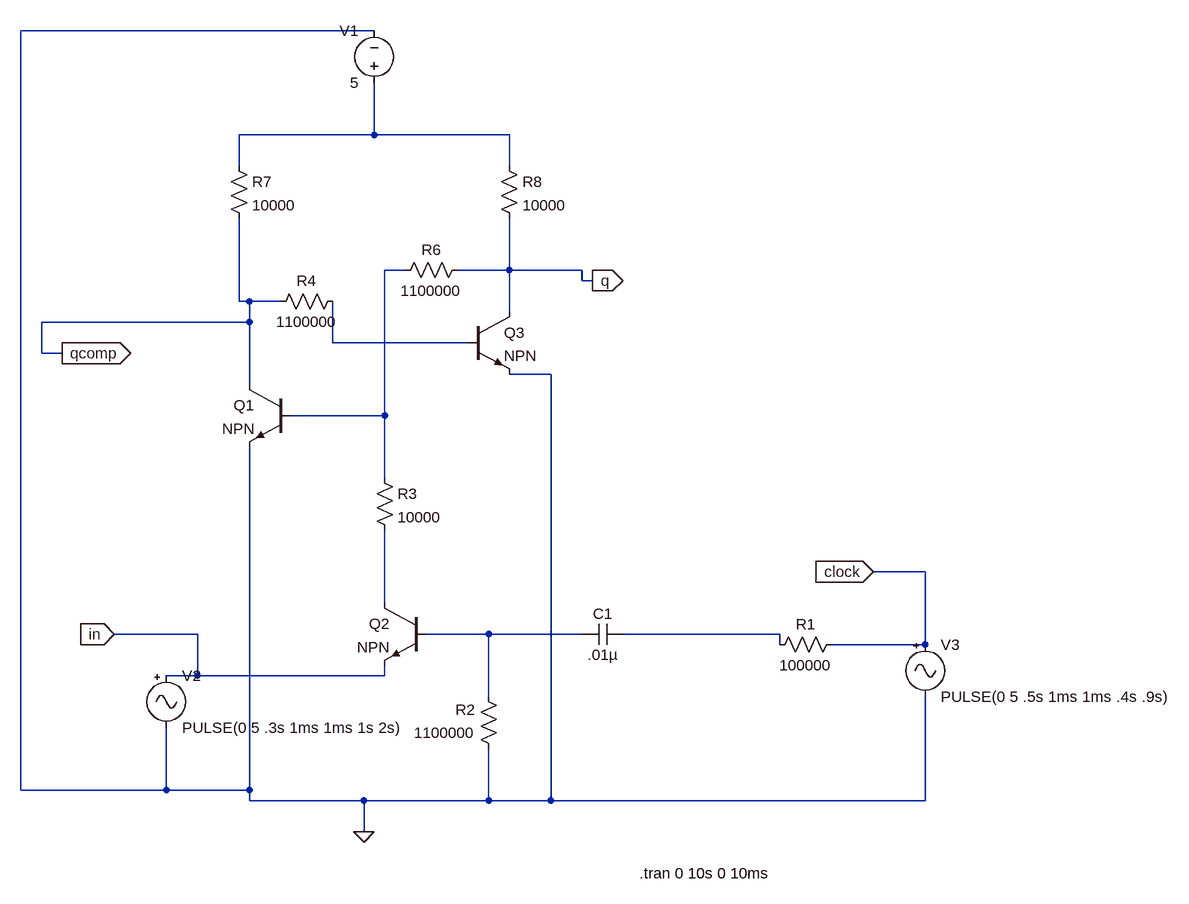
[diagram p0: schematic d flip flop.asc]
d flip flop.asc, the LTspice schematic file:
Version 4.1
SHEET 1 880 960
WIRE -400 -352 -944 -352
WIRE -400 -192 -400 -272
WIRE -400 -192 -608 -192
WIRE -192 -192 -400 -192
WIRE -608 -144 -608 -192
WIRE -192 -144 -192 -192
WIRE -352 16 -384 16
WIRE -192 16 -192 -64
WIRE -192 16 -272 16
WIRE -80 16 -192 16
WIRE -80 32 -80 16
WIRE -64 32 -80 32
WIRE -608 64 -608 -64
WIRE -592 64 -608 64
WIRE -544 64 -592 64
WIRE -192 80 -192 16
WIRE -592 96 -592 64
WIRE -592 96 -912 96
WIRE -464 128 -464 64
WIRE -256 128 -464 128
WIRE -912 144 -912 96
WIRE -880 144 -912 144
WIRE -128 176 -192 176
WIRE -592 192 -592 96
WIRE -384 240 -384 16
WIRE -384 240 -528 240
WIRE -384 336 -384 240
WIRE 448 480 368 480
WIRE -384 528 -384 416
WIRE -672 576 -800 576
WIRE -224 576 -320 576
WIRE -80 576 -224 576
WIRE 224 576 -16 576
WIRE 224 592 224 576
WIRE 448 592 448 480
WIRE 448 592 304 592
WIRE -672 640 -672 576
WIRE -672 640 -720 640
WIRE -384 640 -384 624
WIRE -384 640 -672 640
WIRE -224 672 -224 576
WIRE -944 816 -944 -352
WIRE -720 816 -720 720
WIRE -720 816 -944 816
WIRE -592 816 -592 288
WIRE -592 816 -720 816
WIRE -592 832 -592 816
WIRE -416 832 -592 832
WIRE -224 832 -224 752
WIRE -224 832 -416 832
WIRE -128 832 -128 176
WIRE -128 832 -224 832
WIRE 448 832 448 672
WIRE 448 832 -128 832
WIRE -416 880 -416 832
FLAG -416 880 0
FLAG -64 32 q
IOPIN -64 32 Out
FLAG -880 144 qcomp
IOPIN -880 144 Out
FLAG -800 576 in
IOPIN -800 576 In
FLAG 368 480 clock
IOPIN 368 480 In
SYMBOL npn -256 80 R0
SYMATTR InstName Q3
SYMBOL npn -528 192 M0
SYMATTR InstName Q1
SYMBOL npn -320 528 M0
SYMATTR InstName Q2
SYMBOL res 320 576 R90
WINDOW 0 0 56 VBottom 2
WINDOW 3 32 56 VTop 2
SYMATTR InstName R1
SYMATTR Value 100000
SYMBOL res -208 768 R180
WINDOW 0 36 76 Left 2
WINDOW 3 36 40 Left 2
SYMATTR InstName R2
SYMATTR Value 1100000
SYMBOL cap -16 560 R90
WINDOW 0 0 32 VBottom 2
WINDOW 3 32 32 VTop 2
SYMATTR InstName C1
SYMATTR Value .01µ
SYMBOL res -400 320 R0
SYMATTR InstName R3
SYMATTR Value 10000
SYMBOL res -448 48 R90
WINDOW 0 0 56 VBottom 2
WINDOW 3 32 56 VTop 2
SYMATTR InstName R4
SYMATTR Value 1100000
SYMBOL res -256 0 R90
WINDOW 0 0 56 VBottom 2
WINDOW 3 32 56 VTop 2
SYMATTR InstName R6
SYMATTR Value 1100000
SYMBOL res -624 -160 R0
SYMATTR InstName R7
SYMATTR Value 10000
SYMBOL res -208 -160 R0
SYMATTR InstName R8
SYMATTR Value 10000
SYMBOL voltage -400 -256 R180
WINDOW 0 24 96 Left 2
WINDOW 3 24 16 Left 2
WINDOW 123 0 0 Left 0
WINDOW 39 0 0 Left 0
SYMATTR InstName V1
SYMATTR Value 5
SYMBOL Misc\\signal -720 624 R0
WINDOW 123 0 0 Left 0
WINDOW 39 0 0 Left 0
SYMATTR InstName V2
SYMATTR Value PULSE(0 5 .3s 1ms 1ms 1s 2s)
SYMBOL Misc\\signal 448 576 R0
WINDOW 123 0 0 Left 0
WINDOW 39 0 0 Left 0
SYMATTR InstName V3
SYMATTR Value PULSE(0 5 .5s 1ms 1ms .4s .9s)
TEXT 8 944 Left 2 !.tran 0 10s 0 10ms

The netlist it stands for:
* d flip flop.asc
Q3 q N003 0 0 NPN
Q1 qcomp N002 0 0 NPN
Q2 N004 N005 in 0 NPN
R1 clock N006 100000
R2 0 N005 1100000
C1 N006 N005 .01µ
R3 N002 N004 10000
R4 N003 qcomp 1100000
R6 q N002 1100000
R7 N001 qcomp 10000
R8 N001 q 10000
V1 N001 0 5
V2 in 0 PULSE(0 5 .3s 1ms 1ms 1s 2s)
V3 clock 0 PULSE(0 5 .5s 1ms 1ms .4s .9s)
.model NPN NPN
.model PNP PNP
.lib standard.bjt
.tran 0 10s 0 10ms
.backanno
.end